# Altium schematic sheet RJ45.SchDoc
size 420 x 297 mm; Author: P. Zdunek; CompanyName: WUT ISE; DrawnBy: P. Zdunek; Organization: WUT ISE; Address1: PW ISE; Address2: Nowowiejska 15/19 00-665 Warsaw; Address3: p.zdunek90@gmail.com; DocumentNumber: 9; Revision: 2; SheetNumber: 9; SheetTotal: 10; ModifiedBy: -; CheckedDate: -; Title2: Stage; DivGrp: WUT ISE; Designer: P. Zdunek; ModifiedDate: -; ProjectName: Sensor Box
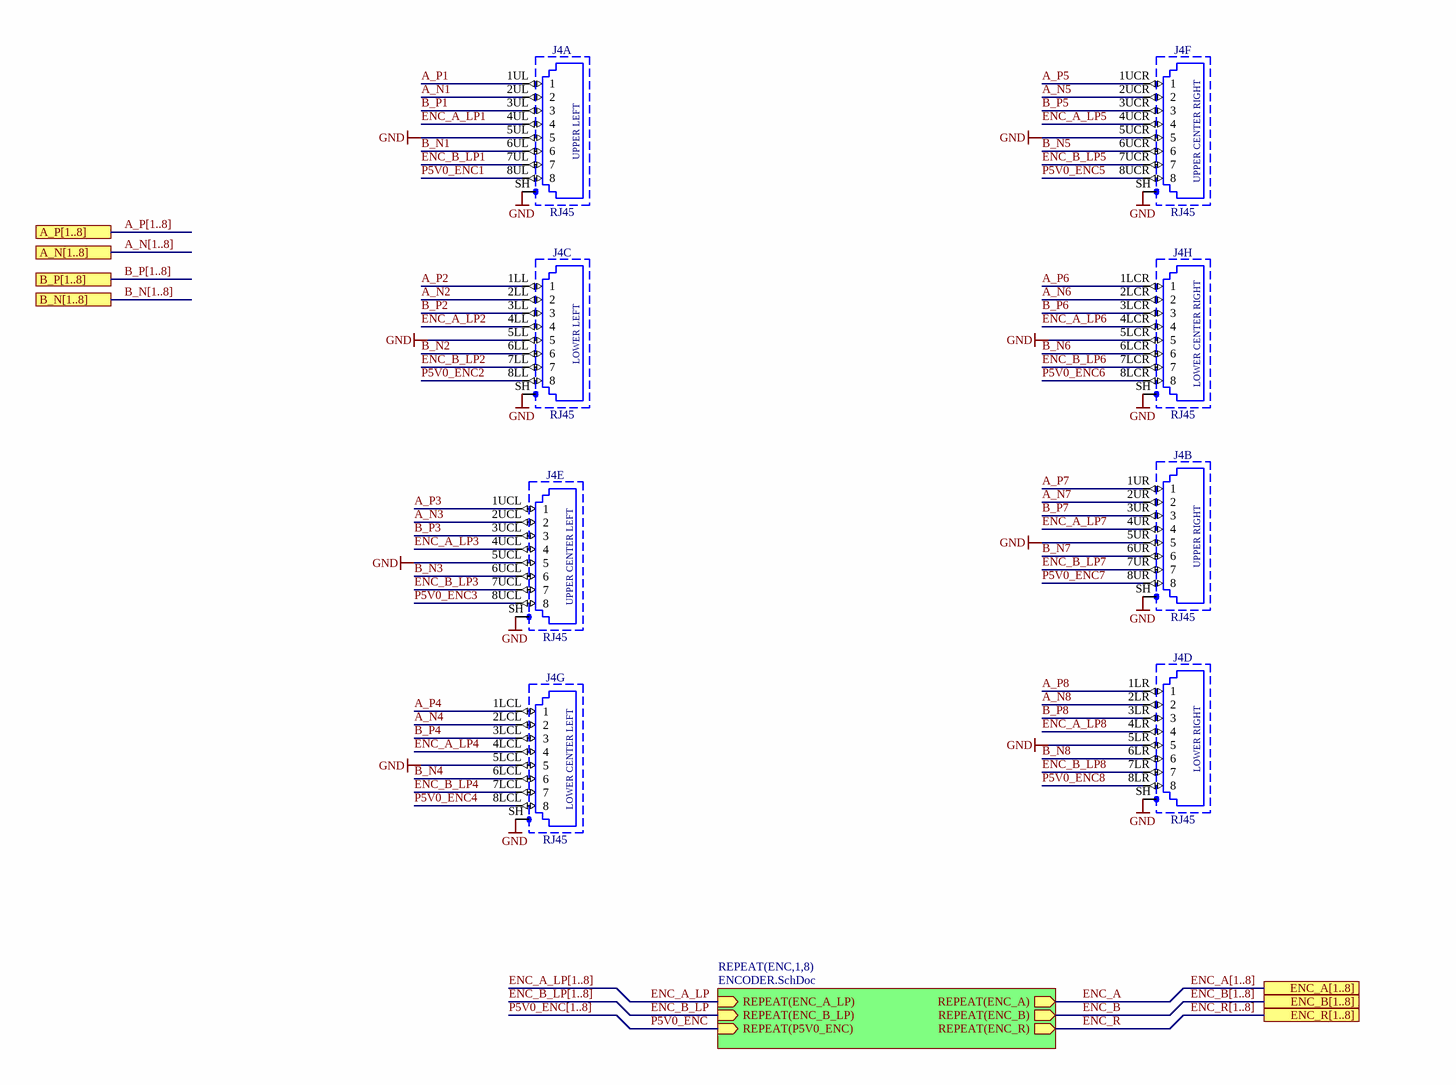
[diagram p0: RJ45.SchDoc, left]
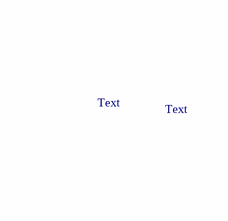
[diagram p1: RJ45.SchDoc, right]

## Parts
J4  RJ45  [TYCO_5569262-1]  (parts A,B,C,D,E,F,G,H of 8)

## Sub-sheets
REPEAT(ENC,1,8) = ENCODER.SchDoc: REPEAT(ENC_R) (out), REPEAT(ENC_B) (out), REPEAT(ENC_A) (out), REPEAT(ENC_B_LP) (in), REPEAT(ENC_A_LP) (in), REPEAT(P5V0_ENC) (in)

## Ports
A_N[1..8], A_P[1..8], B_N[1..8], B_P[1..8], ENC_A[1..8], ENC_B[1..8], ENC_R[1..8]

## Nets
GND: J4.5LCL(5) J4.5LCR(5) J4.5LL(5) J4.5LR(5) J4.5UCL(5) J4.5UCR(5) J4.5UL(5) J4.5UR(5) J4.SH
A_N1: J4.2UL(2)
A_N2: J4.2LL(2)
A_N3: J4.2UCL(2)
A_N4: J4.2LCL(2)
A_N5: J4.2UCR(2)
A_N6: J4.2LCR(2)
A_N7: J4.2UR(2)
A_N8: J4.2LR(2)
A_P1: J4.1UL(1)
A_P2: J4.1LL(1)
A_P3: J4.1UCL(1)
A_P4: J4.1LCL(1)
A_P5: J4.1UCR(1)
A_P6: J4.1LCR(1)
A_P7: J4.1UR(1)
A_P8: J4.1LR(1)
B_N1: J4.6UL(6)
B_N2: J4.6LL(6)
B_N3: J4.6UCL(6)
B_N4: J4.6LCL(6)
B_N5: J4.6UCR(6)
B_N6: J4.6LCR(6)
B_N7: J4.6UR(6)
B_N8: J4.6LR(6)
B_P1: J4.3UL(3)
B_P2: J4.3LL(3)
B_P3: J4.3UCL(3)
B_P4: J4.3LCL(3)
B_P5: J4.3UCR(3)
B_P6: J4.3LCR(3)
B_P7: J4.3UR(3)
B_P8: J4.3LR(3)
ENC_A: sheet REPEAT(ENC,1,8)/REPEAT(ENC_A)
ENC_A_LP: sheet REPEAT(ENC,1,8)/REPEAT(ENC_A_LP)
ENC_A_LP1: J4.4UL(4)
ENC_A_LP2: J4.4LL(4)
ENC_A_LP3: J4.4UCL(4)
ENC_A_LP4: J4.4LCL(4)
ENC_A_LP5: J4.4UCR(4)
ENC_A_LP6: J4.4LCR(4)
ENC_A_LP7: J4.4UR(4)
ENC_A_LP8: J4.4LR(4)
ENC_B: sheet REPEAT(ENC,1,8)/REPEAT(ENC_B)
ENC_B_LP: sheet REPEAT(ENC,1,8)/REPEAT(ENC_B_LP)
ENC_B_LP1: J4.7UL(7)
ENC_B_LP2: J4.7LL(7)
ENC_B_LP3: J4.7UCL(7)
ENC_B_LP4: J4.7LCL(7)
ENC_B_LP5: J4.7UCR(7)
ENC_B_LP6: J4.7LCR(7)
ENC_B_LP7: J4.7UR(7)
ENC_B_LP8: J4.7LR(7)
ENC_R: sheet REPEAT(ENC,1,8)/REPEAT(ENC_R)
P5V0_ENC: sheet REPEAT(ENC,1,8)/REPEAT(P5V0_ENC)
P5V0_ENC1: J4.8UL(8)
P5V0_ENC2: J4.8LL(8)
P5V0_ENC3: J4.8UCL(8)
P5V0_ENC4: J4.8LCL(8)
P5V0_ENC5: J4.8UCR(8)
P5V0_ENC6: J4.8LCR(8)
P5V0_ENC7: J4.8UR(8)
P5V0_ENC8: J4.8LR(8)

## Buses and harness runs
bus A_N[1..8] = port A_N[1..8]
bus A_P[1..8] = port A_P[1..8]
bus B_N[1..8] = port B_N[1..8]
bus B_P[1..8] = port B_P[1..8]
bus ENC_A[1..8] = port ENC_A[1..8]
bus ENC_A_LP[1..8]
bus ENC_B[1..8] = port ENC_B[1..8]
bus ENC_B_LP[1..8]
bus ENC_R[1..8] = port ENC_R[1..8]
bus P5V0_ENC[1..8]

## Notes on the sheet
- Text
- Project/Equipment
- Document
- Designer
- Drawn by
- Check.by
- Copyright WUT ISE 2020.
  This documentation describes Open Hardware and is licensed under the CERN OHL v.1.2. You may redistribute and modify this documentation under the terms of the CERN OHL v.1.2. (http://ohwr.org/CERNOHL). This documentation is distributed WITHOUT ANY EXPRESS OR IMPLIED WARRANTY, INCLUDING OF MERCHANTABILITY, SATISFACTORY QUALITY AND FITNESS FOR A PARTICULAR PURPOSE. Please see the CERN OHL v.1.2 for applicable conditions.
- Contact
- File
- Last Mod.
- Print Date
- Sheet
- Size
- A3
- of
- Rev
- (in symbol TYCO_5569262-1, part A) UPPER LEFT
- (in symbol TYCO_5569262-1, part B) UPPER RIGHT
- (in symbol TYCO_5569262-1, part C) LOWER LEFT
- (in symbol TYCO_5569262-1, part D) LOWER RIGHT
- (in symbol TYCO_5569262-1, part E) UPPER CENTER LEFT
- (in symbol TYCO_5569262-1, part F) UPPER CENTER RIGHT
- (in symbol TYCO_5569262-1, part G) LOWER CENTER LEFT
- (in symbol TYCO_5569262-1, part H) LOWER CENTER RIGHT

## Library data of the parts
J4 = TYCO_5569262-1: Connector 2 x 4 RJ45 + Shield; Part Description: 2 x 4 Port, 8 Positions Stacked RJ45 Jack, with Panel And PCB Ground Tabs, Category 5; Manufacturer: TYCO ELECTRONICS; PressFit: No; Part Number: TYCO_5569262-1; Component Kind: Standard; Component Type: Standard; Pin Count: 65; Family: RJ45; Mounted: Yes; Socket: No; SMD: No; Sense: No; Status: None; Manufacturer Part Number: 5569262-1; ComponentHeight: 26.29mm; HelpURL: \\cern.ch\dfs\Applications\Altium\Datasheets\TYCO_5569262-1.pdf; Author: CERN DEM MR; CreateDate: 12/01/2016; LatestRevisionDate: 12/01/2016